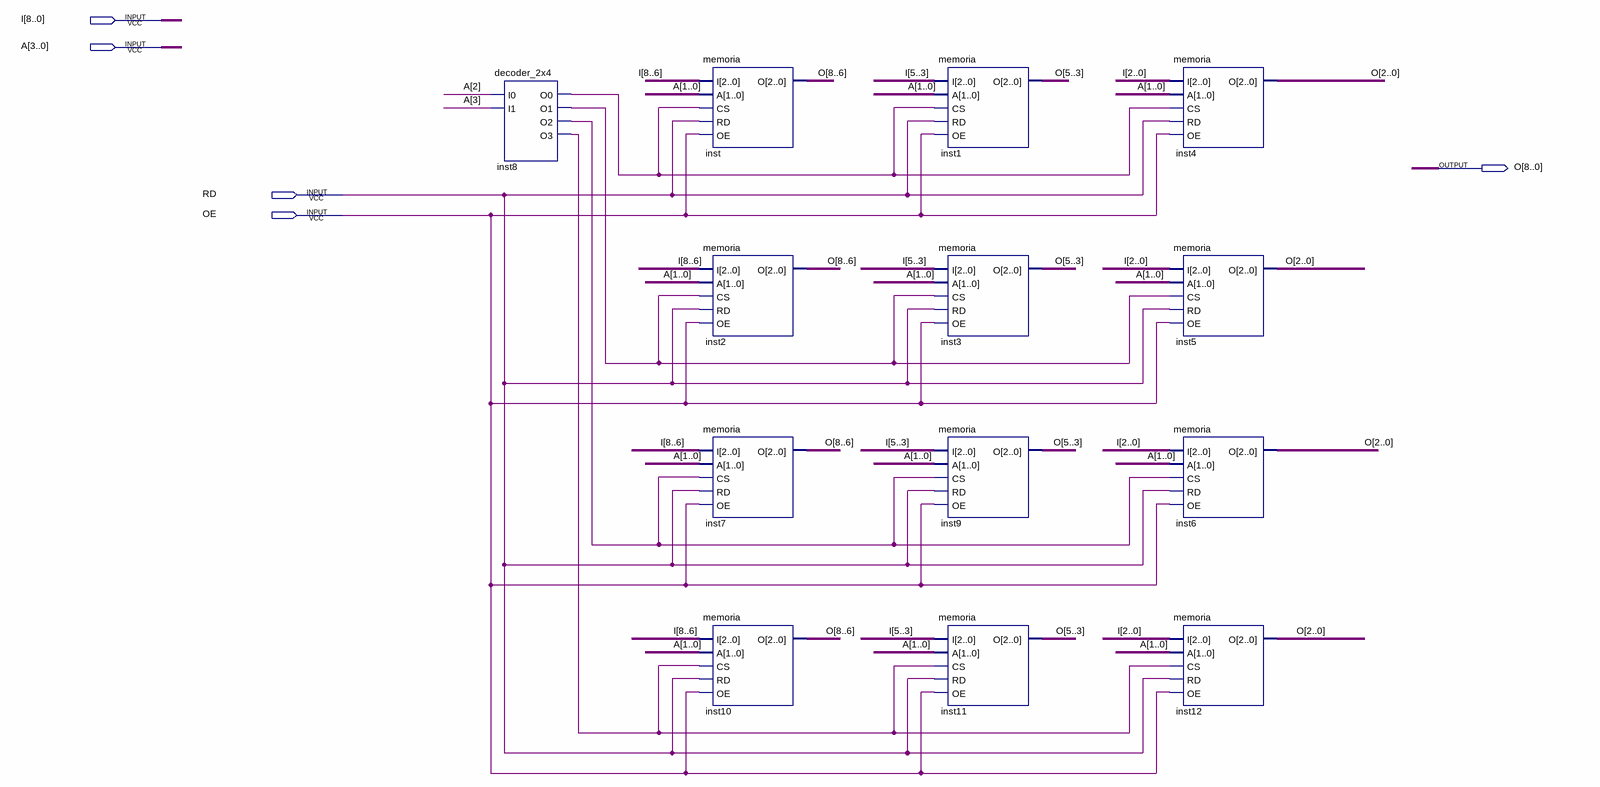
[diagram p0: schematic sheet]
// Quartus schematic memoria16x9.bdf as structural Verilog: 13 symbols, 5 pins
module memoria16x9 (
  input  [8:0] I,
  input  [3:0] A,
  input  RD,
  input  OE,
  output [8:0] O
);

  wire inst8_o0, inst8_o1, inst8_o2, inst8_o3;

  decoder_2x4 inst8 (.I0(A[2]), .I1(A[3]), .O0(inst8_o0), .O1(inst8_o1), .O2(inst8_o2), .O3(inst8_o3));
  memoria inst (.I(I[8:6]), .A(A[1:0]), .CS(inst8_o0), .RD(RD), .OE(OE), .O(O[8:6]));
  memoria inst2 (.I(I[8:6]), .A(A[1:0]), .CS(inst8_o1), .RD(RD), .OE(OE), .O(O[8:6]));
  memoria inst7 (.I(I[8:6]), .A(A[1:0]), .CS(inst8_o2), .RD(RD), .OE(OE), .O(O[8:6]));
  memoria inst10 (.I(I[8:6]), .A(A[1:0]), .CS(inst8_o3), .RD(RD), .OE(OE), .O(O[8:6]));
  memoria inst1 (.I(I[5:3]), .A(A[1:0]), .CS(inst8_o0), .RD(RD), .OE(OE), .O(O[5:3]));
  memoria inst3 (.I(I[5:3]), .A(A[1:0]), .CS(inst8_o1), .RD(RD), .OE(OE), .O(O[5:3]));
  memoria inst9 (.I(I[5:3]), .A(A[1:0]), .CS(inst8_o2), .RD(RD), .OE(OE), .O(O[5:3]));
  memoria inst11 (.I(I[5:3]), .A(A[1:0]), .CS(inst8_o3), .RD(RD), .OE(OE), .O(O[5:3]));
  memoria inst4 (.I(I[2:0]), .A(A[1:0]), .CS(inst8_o0), .RD(RD), .OE(OE), .O(O[2:0]));
  memoria inst5 (.I(I[2:0]), .A(A[1:0]), .CS(inst8_o1), .RD(RD), .OE(OE), .O(O[2:0]));
  memoria inst6 (.I(I[2:0]), .A(A[1:0]), .CS(inst8_o2), .RD(RD), .OE(OE), .O(O[2:0]));
  memoria inst12 (.I(I[2:0]), .A(A[1:0]), .CS(inst8_o3), .RD(RD), .OE(OE), .O(O[2:0]));
endmodule
